# Altium schematic sheet Dual_Processors.SchDoc: FPGA TSK3000 Dual Processor example
size C; Organization: Altium Limited; Address1: L3, 12a Rodborough Rd; Address2: Frenchs Forest; Address3: NSW; Address4: Australia 2086; DocumentNumber: 1; SheetNumber: 1; SheetTotal: 1
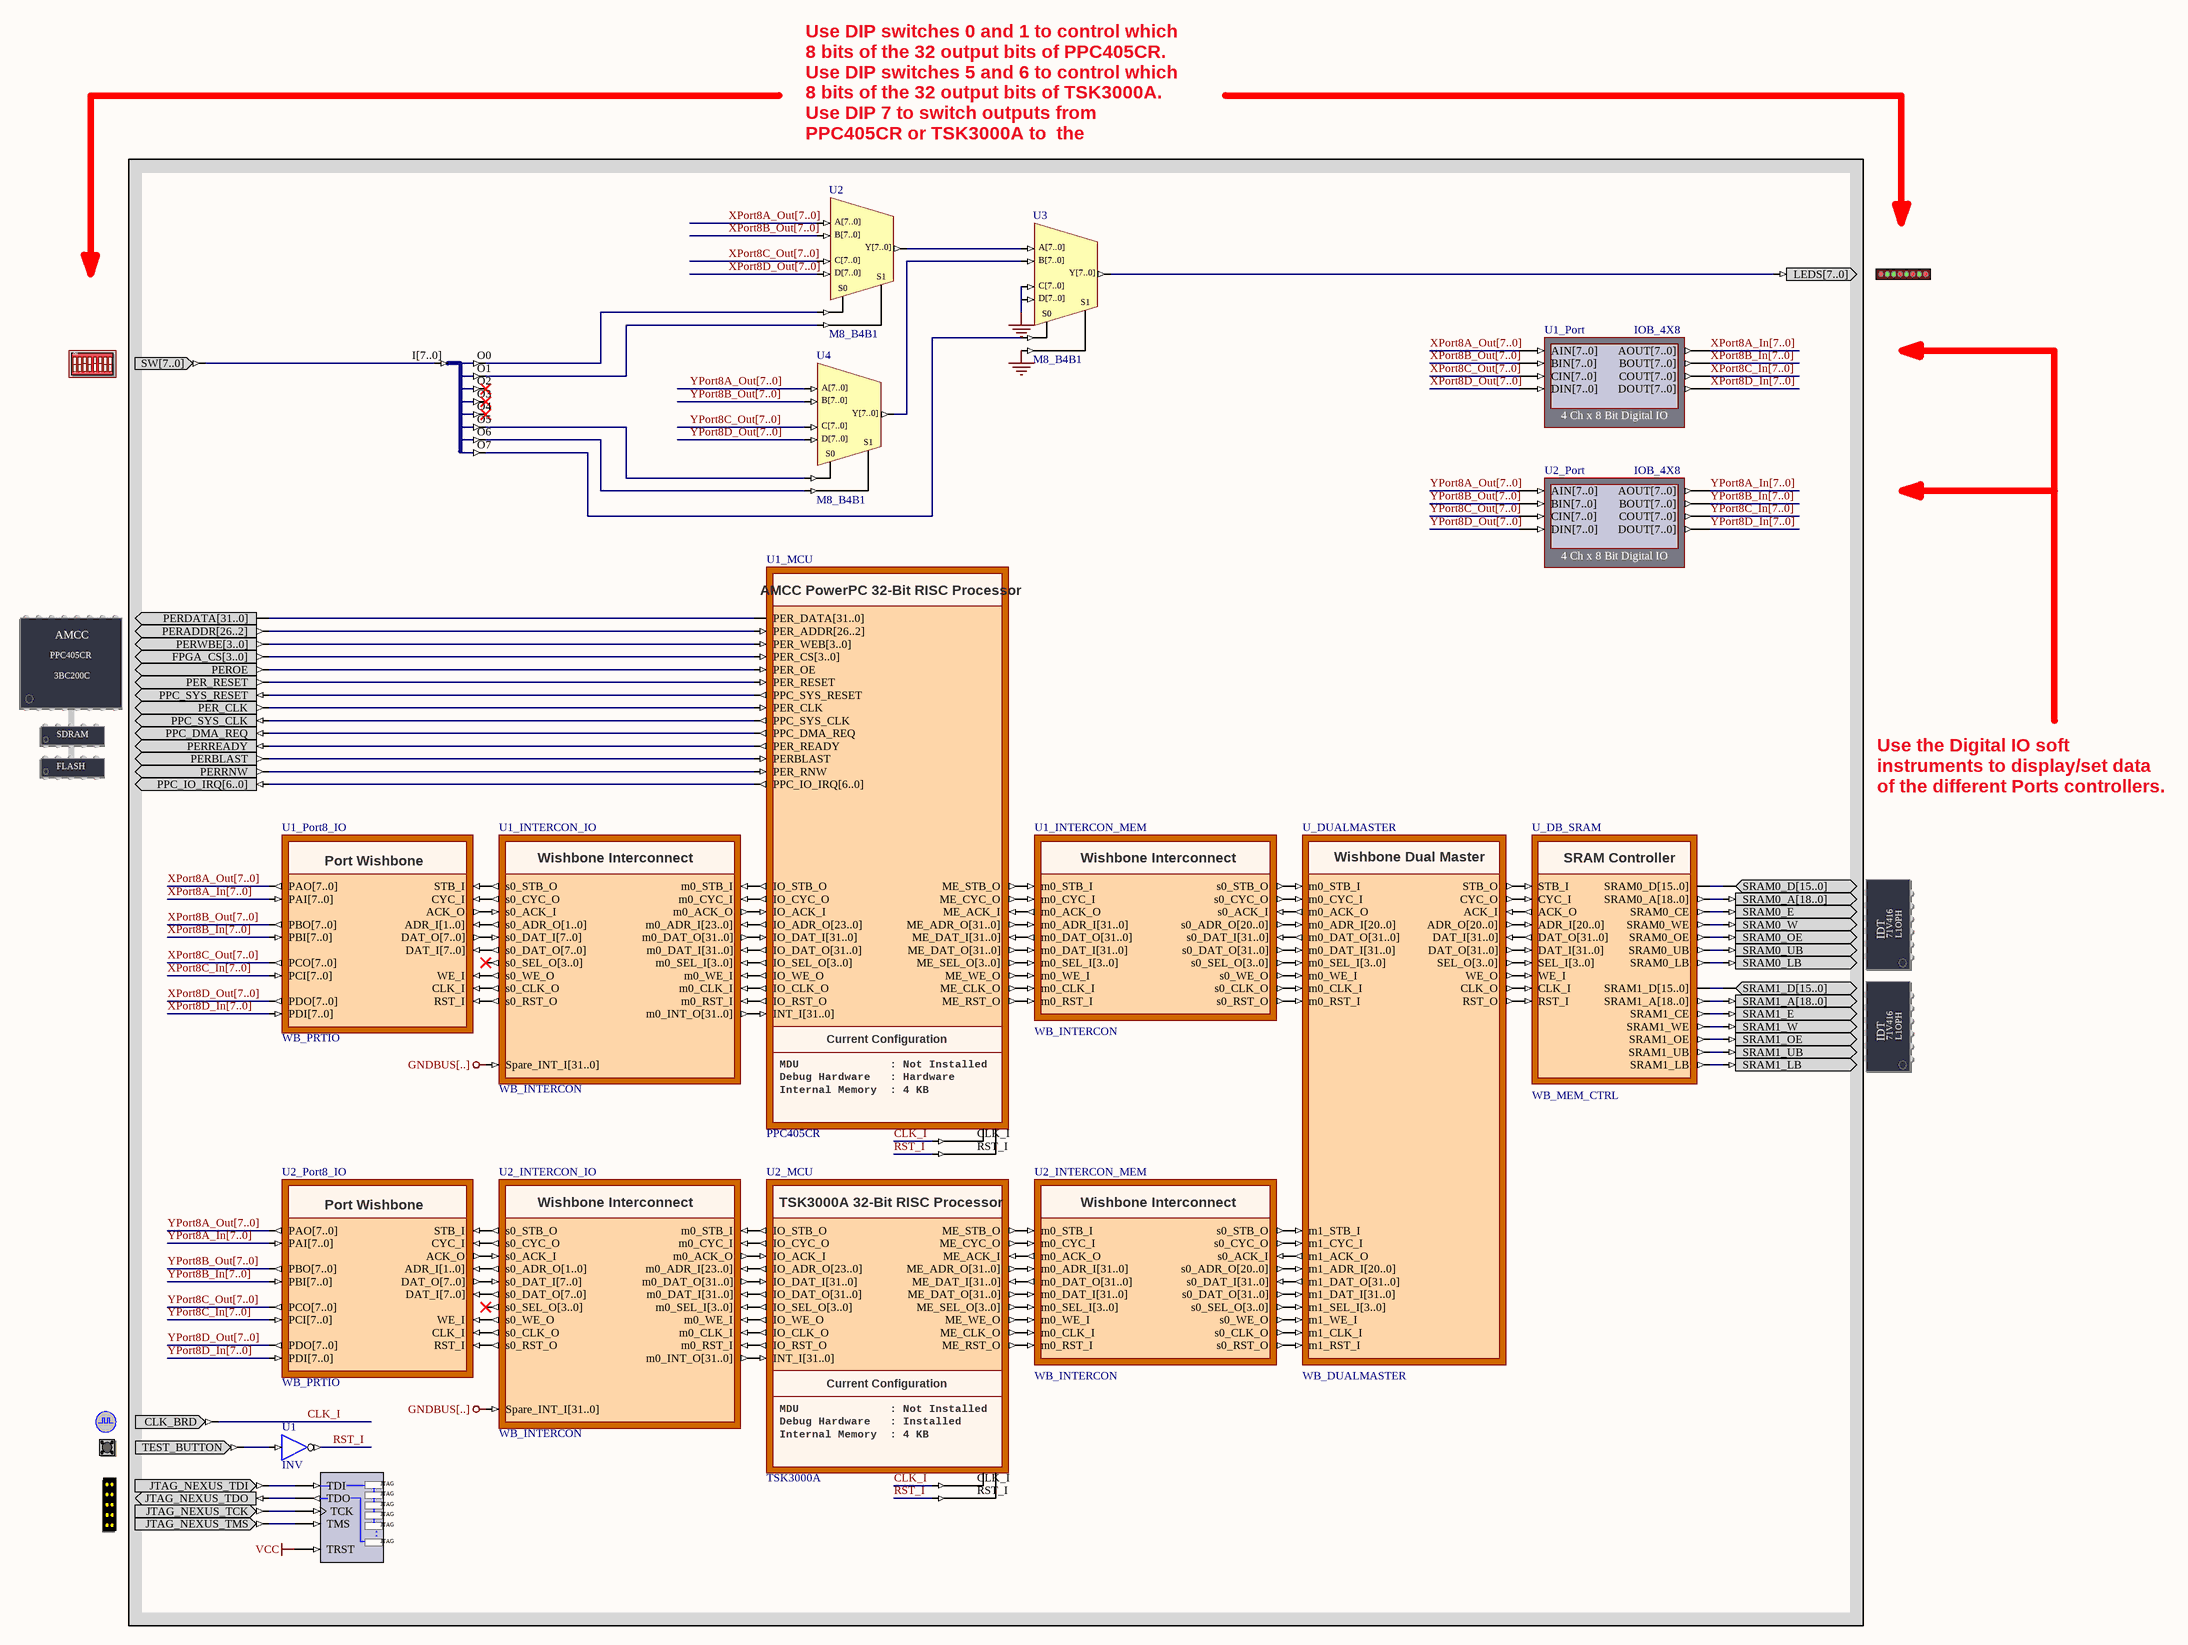
[diagram p0: Dual_Processors.SchDoc]

## Parts
(Parts that share a designator on the sheet are numbered #1, #2 ... from top to bottom, then left to right.)
?#1  LED  (value not drawn)
?#2  DIPSWITCH  (value not drawn)
?#3  PROCESSOR_PPC405CR  (value not drawn)
?#4  SRAM_DAUGHTER0  (value not drawn)
?#5  SRAM_DAUGHTER1  (value not drawn)
?#6  CLOCK_BOARD  (value not drawn)
?#7  TEST_BUTTON  (value not drawn)
?#8  NEXUS_JTAG_CONNECTOR  (value not drawn)
NEXUS_JTAG_PORT  NEXUS_JTAG_PORT  (value not drawn)
U1  INV
U1_INTERCON_IO  WB_INTERCON
U1_INTERCON_MEM  WB_INTERCON
U1_MCU  PPC405CR
U1_Port  IOB_4X8
U1_Port8_IO  WB_PRTIO
U2  M8_B4B1
U2_INTERCON_IO  WB_INTERCON
U2_INTERCON_MEM  WB_INTERCON
U2_MCU  TSK3000A
U2_Port  IOB_4X8
U2_Port8_IO  WB_PRTIO
U3  M8_B4B1
U4  M8_B4B1
U11  J8B_8S  (value not drawn)
U_DB_SRAM  WB_MEM_CTRL
U_DUALMASTER  WB_DUALMASTER

## Nets
GND: U3.S1
GNDBUS[..]: U1_INTERCON_IO.Spare_INT_I[31..0] U2_INTERCON_IO.Spare_INT_I[31..0] U3.C[7..0] U3.D[7..0]
VCC: NEXUS_JTAG_PORT.TRST
CLK_I: ?#6.CLK_BRD U1_MCU.CLK_I U2_MCU.CLK_I
RST_I: U1.O U1_MCU.RST_I U2_MCU.RST_I
XPort8A_In[7..0]: U1_Port.AOUT[7..0] U1_Port8_IO.PAI[7..0]
XPort8A_Out[7..0]: U1_Port.AIN[7..0] U1_Port8_IO.PAO[7..0] U2.A[7..0]
XPort8B_In[7..0]: U1_Port.BOUT[7..0] U1_Port8_IO.PBI[7..0]
XPort8B_Out[7..0]: U1_Port.BIN[7..0] U1_Port8_IO.PBO[7..0] U2.B[7..0]
XPort8C_In[7..0]: U1_Port.COUT[7..0] U1_Port8_IO.PCI[7..0]
XPort8C_Out[7..0]: U1_Port.CIN[7..0] U1_Port8_IO.PCO[7..0] U2.C[7..0]
XPort8D_In[7..0]: U1_Port.DOUT[7..0] U1_Port8_IO.PDI[7..0]
XPort8D_Out[7..0]: U1_Port.DIN[7..0] U1_Port8_IO.PDO[7..0] U2.D[7..0]
YPort8A_In[7..0]: U2_Port.AOUT[7..0] U2_Port8_IO.PAI[7..0]
YPort8A_Out[7..0]: U2_Port.AIN[7..0] U2_Port8_IO.PAO[7..0] U4.A[7..0]
YPort8B_In[7..0]: U2_Port.BOUT[7..0] U2_Port8_IO.PBI[7..0]
YPort8B_Out[7..0]: U2_Port.BIN[7..0] U2_Port8_IO.PBO[7..0] U4.B[7..0]
YPort8C_In[7..0]: U2_Port.COUT[7..0] U2_Port8_IO.PCI[7..0]
YPort8C_Out[7..0]: U2_Port.CIN[7..0] U2_Port8_IO.PCO[7..0] U4.C[7..0]
YPort8D_In[7..0]: U2_Port.DOUT[7..0] U2_Port8_IO.PDI[7..0]
YPort8D_Out[7..0]: U2_Port.DIN[7..0] U2_Port8_IO.PDO[7..0] U4.D[7..0]
Net?#1_LEDS[7..0]: ?#1.LEDS[7..0] U3.Y[7..0]
Net?#2_SW[7..0]: ?#2.SW[7..0] U11.I[7..0]
Net?#3_FPGA_CS[3..0]: ?#3.FPGA_CS[3..0] U1_MCU.PER_CS[3..0]
Net?#3_PER_CLK: ?#3.PER_CLK U1_MCU.PER_CLK
Net?#3_PER_RESET: ?#3.PER_RESET U1_MCU.PER_RESET
Net?#3_PERADDR[26..2]: ?#3.PERADDR[26..2] U1_MCU.PER_ADDR[26..2]
Net?#3_PERBLAST: ?#3.PERBLAST U1_MCU.PERBLAST
Net?#3_PERDATA[31..0]: ?#3.PERDATA[31..0] U1_MCU.PER_DATA[31..0]
Net?#3_PEROE: ?#3.PEROE U1_MCU.PER_OE
Net?#3_PERREADY: ?#3.PERREADY U1_MCU.PER_READY
Net?#3_PERRNW: ?#3.PERRNW U1_MCU.PER_RNW
Net?#3_PERWBE[3..0]: ?#3.PERWBE[3..0] U1_MCU.PER_WEB[3..0]
Net?#3_PPC_DMA_REQ: ?#3.PPC_DMA_REQ U1_MCU.PPC_DMA_REQ
Net?#3_PPC_IO_IRQ[6..0]: ?#3.PPC_IO_IRQ[6..0] U1_MCU.PPC_IO_IRQ[6..0]
Net?#3_PPC_SYS_CLK: ?#3.PPC_SYS_CLK U1_MCU.PPC_SYS_CLK
Net?#3_PPC_SYS_RESET: ?#3.PPC_SYS_RESET U1_MCU.PPC_SYS_RESET
Net?#4_SRAM0_A[18..0]: ?#4.SRAM0_A[18..0] U_DB_SRAM.SRAM0_A[18..0]
Net?#4_SRAM0_D[15..0]: ?#4.SRAM0_D[15..0] U_DB_SRAM.SRAM0_D[15..0]
Net?#4_SRAM0_E: ?#4.SRAM0_E U_DB_SRAM.SRAM0_CE
Net?#4_SRAM0_LB: ?#4.SRAM0_LB U_DB_SRAM.SRAM0_LB
Net?#4_SRAM0_OE: ?#4.SRAM0_OE U_DB_SRAM.SRAM0_OE
Net?#4_SRAM0_UB: ?#4.SRAM0_UB U_DB_SRAM.SRAM0_UB
Net?#4_SRAM0_W: ?#4.SRAM0_W U_DB_SRAM.SRAM0_WE
Net?#5_SRAM1_A[18..0]: ?#5.SRAM1_A[18..0] U_DB_SRAM.SRAM1_A[18..0]
Net?#5_SRAM1_D[15..0]: ?#5.SRAM1_D[15..0] U_DB_SRAM.SRAM1_D[15..0]
Net?#5_SRAM1_E: ?#5.SRAM1_E U_DB_SRAM.SRAM1_CE
Net?#5_SRAM1_LB: ?#5.SRAM1_LB U_DB_SRAM.SRAM1_LB
Net?#5_SRAM1_OE: ?#5.SRAM1_OE U_DB_SRAM.SRAM1_OE
Net?#5_SRAM1_UB: ?#5.SRAM1_UB U_DB_SRAM.SRAM1_UB
Net?#5_SRAM1_W: ?#5.SRAM1_W U_DB_SRAM.SRAM1_WE
Net?#7_TEST_BUTTON: ?#7.TEST_BUTTON U1.I
Net?#8_JTAG_NEXUS_TCK: ?#8.JTAG_NEXUS_TCK NEXUS_JTAG_PORT.TCK
Net?#8_JTAG_NEXUS_TDI: ?#8.JTAG_NEXUS_TDI NEXUS_JTAG_PORT.TDI
Net?#8_JTAG_NEXUS_TDO: ?#8.JTAG_NEXUS_TDO NEXUS_JTAG_PORT.TDO
Net?#8_JTAG_NEXUS_TMS: ?#8.JTAG_NEXUS_TMS NEXUS_JTAG_PORT.TMS
NetU1_INTERCON_IO_m0_ACK_O: U1_INTERCON_IO.m0_ACK_O U1_MCU.IO_ACK_I
NetU1_INTERCON_IO_m0_ADR_I[23..0]: U1_INTERCON_IO.m0_ADR_I[23..0] U1_MCU.IO_ADR_O[23..0]
NetU1_INTERCON_IO_m0_CLK_I: U1_INTERCON_IO.m0_CLK_I U1_MCU.IO_CLK_O
NetU1_INTERCON_IO_m0_CYC_I: U1_INTERCON_IO.m0_CYC_I U1_MCU.IO_CYC_O
NetU1_INTERCON_IO_m0_DAT_I[31..0]: U1_INTERCON_IO.m0_DAT_I[31..0] U1_MCU.IO_DAT_O[31..0]
NetU1_INTERCON_IO_m0_DAT_O[31..0]: U1_INTERCON_IO.m0_DAT_O[31..0] U1_MCU.IO_DAT_I[31..0]
NetU1_INTERCON_IO_m0_INT_O[31..0]: U1_INTERCON_IO.m0_INT_O[31..0] U1_MCU.INT_I[31..0]
NetU1_INTERCON_IO_m0_RST_I: U1_INTERCON_IO.m0_RST_I U1_MCU.IO_RST_O
NetU1_INTERCON_IO_m0_SEL_I[3..0]: U1_INTERCON_IO.m0_SEL_I[3..0] U1_MCU.IO_SEL_O[3..0]
NetU1_INTERCON_IO_m0_STB_I: U1_INTERCON_IO.m0_STB_I U1_MCU.IO_STB_O
NetU1_INTERCON_IO_m0_WE_I: U1_INTERCON_IO.m0_WE_I U1_MCU.IO_WE_O
NetU1_INTERCON_IO_s0_ACK_I: U1_INTERCON_IO.s0_ACK_I U1_Port8_IO.ACK_O
NetU1_INTERCON_IO_s0_ADR_O[1..0]: U1_INTERCON_IO.s0_ADR_O[1..0] U1_Port8_IO.ADR_I[1..0]
NetU1_INTERCON_IO_s0_CLK_O: U1_INTERCON_IO.s0_CLK_O U1_Port8_IO.CLK_I
NetU1_INTERCON_IO_s0_CYC_O: U1_INTERCON_IO.s0_CYC_O U1_Port8_IO.CYC_I
NetU1_INTERCON_IO_s0_DAT_I[7..0]: U1_INTERCON_IO.s0_DAT_I[7..0] U1_Port8_IO.DAT_O[7..0]
NetU1_INTERCON_IO_s0_DAT_O[7..0]: U1_INTERCON_IO.s0_DAT_O[7..0] U1_Port8_IO.DAT_I[7..0]
NetU1_INTERCON_IO_s0_RST_O: U1_INTERCON_IO.s0_RST_O U1_Port8_IO.RST_I
NetU1_INTERCON_IO_s0_STB_O: U1_INTERCON_IO.s0_STB_O U1_Port8_IO.STB_I
NetU1_INTERCON_IO_s0_WE_O: U1_INTERCON_IO.s0_WE_O U1_Port8_IO.WE_I
NetU1_INTERCON_MEM_m0_ACK_O: U1_INTERCON_MEM.m0_ACK_O U1_MCU.ME_ACK_I
NetU1_INTERCON_MEM_m0_ADR_I[31..0]: U1_INTERCON_MEM.m0_ADR_I[31..0] U1_MCU.ME_ADR_O[31..0]
NetU1_INTERCON_MEM_m0_CLK_I: U1_INTERCON_MEM.m0_CLK_I U1_MCU.ME_CLK_O
NetU1_INTERCON_MEM_m0_CYC_I: U1_INTERCON_MEM.m0_CYC_I U1_MCU.ME_CYC_O
NetU1_INTERCON_MEM_m0_DAT_I[31..0]: U1_INTERCON_MEM.m0_DAT_I[31..0] U1_MCU.ME_DAT_O[31..0]
NetU1_INTERCON_MEM_m0_DAT_O[31..0]: U1_INTERCON_MEM.m0_DAT_O[31..0] U1_MCU.ME_DAT_I[31..0]
NetU1_INTERCON_MEM_m0_RST_I: U1_INTERCON_MEM.m0_RST_I U1_MCU.ME_RST_O
NetU1_INTERCON_MEM_m0_SEL_I[3..0]: U1_INTERCON_MEM.m0_SEL_I[3..0] U1_MCU.ME_SEL_O[3..0]
NetU1_INTERCON_MEM_m0_STB_I: U1_INTERCON_MEM.m0_STB_I U1_MCU.ME_STB_O
NetU1_INTERCON_MEM_m0_WE_I: U1_INTERCON_MEM.m0_WE_I U1_MCU.ME_WE_O
NetU1_INTERCON_MEM_s0_ACK_I: U1_INTERCON_MEM.s0_ACK_I U_DUALMASTER.m0_ACK_O
NetU1_INTERCON_MEM_s0_ADR_O[20..0]: U1_INTERCON_MEM.s0_ADR_O[20..0] U_DUALMASTER.m0_ADR_I[20..0]
NetU1_INTERCON_MEM_s0_CLK_O: U1_INTERCON_MEM.s0_CLK_O U_DUALMASTER.m0_CLK_I
NetU1_INTERCON_MEM_s0_CYC_O: U1_INTERCON_MEM.s0_CYC_O U_DUALMASTER.m0_CYC_I
NetU1_INTERCON_MEM_s0_DAT_I[31..0]: U1_INTERCON_MEM.s0_DAT_I[31..0] U_DUALMASTER.m0_DAT_O[31..0]
NetU1_INTERCON_MEM_s0_DAT_O[31..0]: U1_INTERCON_MEM.s0_DAT_O[31..0] U_DUALMASTER.m0_DAT_I[31..0]
NetU1_INTERCON_MEM_s0_RST_O: U1_INTERCON_MEM.s0_RST_O U_DUALMASTER.m0_RST_I
NetU1_INTERCON_MEM_s0_SEL_O[3..0]: U1_INTERCON_MEM.s0_SEL_O[3..0] U_DUALMASTER.m0_SEL_I[3..0]
NetU1_INTERCON_MEM_s0_STB_O: U1_INTERCON_MEM.s0_STB_O U_DUALMASTER.m0_STB_I
NetU1_INTERCON_MEM_s0_WE_O: U1_INTERCON_MEM.s0_WE_O U_DUALMASTER.m0_WE_I
NetU2_INTERCON_IO_m0_ACK_O: U2_INTERCON_IO.m0_ACK_O U2_MCU.IO_ACK_I
NetU2_INTERCON_IO_m0_ADR_I[23..0]: U2_INTERCON_IO.m0_ADR_I[23..0] U2_MCU.IO_ADR_O[23..0]
NetU2_INTERCON_IO_m0_CLK_I: U2_INTERCON_IO.m0_CLK_I U2_MCU.IO_CLK_O
NetU2_INTERCON_IO_m0_CYC_I: U2_INTERCON_IO.m0_CYC_I U2_MCU.IO_CYC_O
NetU2_INTERCON_IO_m0_DAT_I[31..0]: U2_INTERCON_IO.m0_DAT_I[31..0] U2_MCU.IO_DAT_O[31..0]
NetU2_INTERCON_IO_m0_DAT_O[31..0]: U2_INTERCON_IO.m0_DAT_O[31..0] U2_MCU.IO_DAT_I[31..0]
NetU2_INTERCON_IO_m0_INT_O[31..0]: U2_INTERCON_IO.m0_INT_O[31..0] U2_MCU.INT_I[31..0]
NetU2_INTERCON_IO_m0_RST_I: U2_INTERCON_IO.m0_RST_I U2_MCU.IO_RST_O
NetU2_INTERCON_IO_m0_SEL_I[3..0]: U2_INTERCON_IO.m0_SEL_I[3..0] U2_MCU.IO_SEL_O[3..0]
NetU2_INTERCON_IO_m0_STB_I: U2_INTERCON_IO.m0_STB_I U2_MCU.IO_STB_O
NetU2_INTERCON_IO_m0_WE_I: U2_INTERCON_IO.m0_WE_I U2_MCU.IO_WE_O
NetU2_INTERCON_IO_s0_ACK_I: U2_INTERCON_IO.s0_ACK_I U2_Port8_IO.ACK_O
NetU2_INTERCON_IO_s0_ADR_O[1..0]: U2_INTERCON_IO.s0_ADR_O[1..0] U2_Port8_IO.ADR_I[1..0]
NetU2_INTERCON_IO_s0_CLK_O: U2_INTERCON_IO.s0_CLK_O U2_Port8_IO.CLK_I
NetU2_INTERCON_IO_s0_CYC_O: U2_INTERCON_IO.s0_CYC_O U2_Port8_IO.CYC_I
NetU2_INTERCON_IO_s0_DAT_I[7..0]: U2_INTERCON_IO.s0_DAT_I[7..0] U2_Port8_IO.DAT_O[7..0]
NetU2_INTERCON_IO_s0_DAT_O[7..0]: U2_INTERCON_IO.s0_DAT_O[7..0] U2_Port8_IO.DAT_I[7..0]
NetU2_INTERCON_IO_s0_RST_O: U2_INTERCON_IO.s0_RST_O U2_Port8_IO.RST_I
NetU2_INTERCON_IO_s0_STB_O: U2_INTERCON_IO.s0_STB_O U2_Port8_IO.STB_I
NetU2_INTERCON_IO_s0_WE_O: U2_INTERCON_IO.s0_WE_O U2_Port8_IO.WE_I
NetU2_INTERCON_MEM_m0_ACK_O: U2_INTERCON_MEM.m0_ACK_O U2_MCU.ME_ACK_I
NetU2_INTERCON_MEM_m0_ADR_I[31..0]: U2_INTERCON_MEM.m0_ADR_I[31..0] U2_MCU.ME_ADR_O[31..0]
NetU2_INTERCON_MEM_m0_CLK_I: U2_INTERCON_MEM.m0_CLK_I U2_MCU.ME_CLK_O
NetU2_INTERCON_MEM_m0_CYC_I: U2_INTERCON_MEM.m0_CYC_I U2_MCU.ME_CYC_O
NetU2_INTERCON_MEM_m0_DAT_I[31..0]: U2_INTERCON_MEM.m0_DAT_I[31..0] U2_MCU.ME_DAT_O[31..0]
NetU2_INTERCON_MEM_m0_DAT_O[31..0]: U2_INTERCON_MEM.m0_DAT_O[31..0] U2_MCU.ME_DAT_I[31..0]
NetU2_INTERCON_MEM_m0_RST_I: U2_INTERCON_MEM.m0_RST_I U2_MCU.ME_RST_O
NetU2_INTERCON_MEM_m0_SEL_I[3..0]: U2_INTERCON_MEM.m0_SEL_I[3..0] U2_MCU.ME_SEL_O[3..0]
NetU2_INTERCON_MEM_m0_STB_I: U2_INTERCON_MEM.m0_STB_I U2_MCU.ME_STB_O
NetU2_INTERCON_MEM_m0_WE_I: U2_INTERCON_MEM.m0_WE_I U2_MCU.ME_WE_O
NetU2_INTERCON_MEM_s0_ACK_I: U2_INTERCON_MEM.s0_ACK_I U_DUALMASTER.m1_ACK_O
NetU2_INTERCON_MEM_s0_ADR_O[20..0]: U2_INTERCON_MEM.s0_ADR_O[20..0] U_DUALMASTER.m1_ADR_I[20..0]
NetU2_INTERCON_MEM_s0_CLK_O: U2_INTERCON_MEM.s0_CLK_O U_DUALMASTER.m1_CLK_I
NetU2_INTERCON_MEM_s0_CYC_O: U2_INTERCON_MEM.s0_CYC_O U_DUALMASTER.m1_CYC_I
NetU2_INTERCON_MEM_s0_DAT_I[31..0]: U2_INTERCON_MEM.s0_DAT_I[31..0] U_DUALMASTER.m1_DAT_O[31..0]
NetU2_INTERCON_MEM_s0_DAT_O[31..0]: U2_INTERCON_MEM.s0_DAT_O[31..0] U_DUALMASTER.m1_DAT_I[31..0]
NetU2_INTERCON_MEM_s0_RST_O: U2_INTERCON_MEM.s0_RST_O U_DUALMASTER.m1_RST_I
NetU2_INTERCON_MEM_s0_SEL_O[3..0]: U2_INTERCON_MEM.s0_SEL_O[3..0] U_DUALMASTER.m1_SEL_I[3..0]
NetU2_INTERCON_MEM_s0_STB_O: U2_INTERCON_MEM.s0_STB_O U_DUALMASTER.m1_STB_I
NetU2_INTERCON_MEM_s0_WE_O: U2_INTERCON_MEM.s0_WE_O U_DUALMASTER.m1_WE_I
NetU2_S0: U2.S0 U11.O0
NetU2_S1: U2.S1 U11.O1
NetU2_Y[7..0]: U2.Y[7..0] U3.A[7..0]
NetU3_B[7..0]: U3.B[7..0] U4.Y[7..0]
NetU3_S0: U3.S0 U11.O7
NetU4_S0: U4.S0 U11.O5
NetU4_S1: U4.S1 U11.O6
NetU_DB_SRAM_ACK_O: U_DB_SRAM.ACK_O U_DUALMASTER.ACK_I
NetU_DB_SRAM_ADR_I[20..0]: U_DB_SRAM.ADR_I[20..0] U_DUALMASTER.ADR_O[20..0]
NetU_DB_SRAM_CLK_I: U_DB_SRAM.CLK_I U_DUALMASTER.CLK_O
NetU_DB_SRAM_CYC_I: U_DB_SRAM.CYC_I U_DUALMASTER.CYC_O
NetU_DB_SRAM_DAT_I[31..0]: U_DB_SRAM.DAT_I[31..0] U_DUALMASTER.DAT_O[31..0]
NetU_DB_SRAM_DAT_O[31..0]: U_DB_SRAM.DAT_O[31..0] U_DUALMASTER.DAT_I[31..0]
NetU_DB_SRAM_RST_I: U_DB_SRAM.RST_I U_DUALMASTER.RST_O
NetU_DB_SRAM_SEL_I[3..0]: U_DB_SRAM.SEL_I[3..0] U_DUALMASTER.SEL_O[3..0]
NetU_DB_SRAM_STB_I: U_DB_SRAM.STB_I U_DUALMASTER.STB_O
NetU_DB_SRAM_WE_I: U_DB_SRAM.WE_I U_DUALMASTER.WE_O

Not connected (* = marked no-connect by the designer): U1_INTERCON_IO s0_SEL_O[3..0]*; U2_INTERCON_IO s0_SEL_O[3..0]*; U11 O2* O3* O4*

## Buses and harness runs
bus XPort8A_In[7..0]
bus XPort8A_Out[7..0]
bus XPort8B_In[7..0]
bus XPort8B_Out[7..0]
bus XPort8C_In[7..0]
bus XPort8C_Out[7..0]
bus XPort8D_In[7..0]
bus XPort8D_Out[7..0]
bus YPort8A_In[7..0]
bus YPort8A_Out[7..0]
bus YPort8B_In[7..0]
bus YPort8B_Out[7..0]
bus YPort8C_In[7..0]
bus YPort8C_Out[7..0]
bus YPort8D_In[7..0]
bus YPort8D_Out[7..0]

## Notes on the sheet
- Use DIP switches 0 and 1 to control which 8 bits of the 32 output bits of PPC405CR.
  Use DIP switches 5 and 6 to control which 8 bits of the 32 output bits of TSK3000A.
  Use DIP 7 to switch outputs from PPC405CR or TSK3000A to  the NanoBoard LEDs.
- Use the Digital IO soft instruments to display/set data of the different Ports controllers.
- Title
- Size:
- Date:
- File:
- C
- Number:
- Time:
- Revision:
- Sheet
- of
- (in symbol DIPSWITCH) ON; 1; 2; 3; 4; 5; 6; 7; 8
- (in symbol NEXUS_JTAG_PORT) JTAG; .
- (in symbol PPC405CR) AMCC PowerPC 32-Bit RISC Processor; Current Configuration; MDU              : Not Installed; Debug Hardware   : Hardware; Internal Memory  : 4 KB
- (in symbol PROCESSOR_PPC405CR) AMCC; PPC405CR; 3BC200C; SDRAM; FLASH
- (in symbol SRAM_DAUGHTER0) IDT; 71V416; L1OPH
- (in symbol SRAM_DAUGHTER1) IDT; 71V416; L1OPH
- (in symbol TSK3000A) TSK3000A 32-Bit RISC Processor; Current Configuration; MDU              : Not Installed; Debug Hardware   : Installed; Internal Memory  : 4 KB
- (in symbol WB_DUALMASTER) Wishbone Dual Master
- (in symbol WB_INTERCON) Wishbone Interconnect
- (in symbol WB_MEM_CTRL) SRAM Controller
- (in symbol WB_PRTIO) Port Wishbone

## Library data of the parts
?#1 = LED: 8-Way LEDS; PortComponent: True; Published: 19-Nov-2003; Publisher: Altium Limited
?#2 = DIPSWITCH: 8-Way Dip Switch; PortComponent: True; Published: 19-Nov-2003; Publisher: Altium Limited
?#3 = PROCESSOR_PPC405CR: AMCC PowerPC 405CR Embedded Processor; PortComponent: True; Published: 25-Aug-2005; Publisher: Altium Limited; HelpURL: https://www.amcc.com/MyAMCC/jsp/public/productDetail/product_detail.jsp?productID=PPC405CR
?#4 = SRAM_DAUGHTER0: SRAM - 0 Module - Daughterboard; PortComponent: True; Published: 13-May-2004; Publisher: Altium Limited
?#5 = SRAM_DAUGHTER1: SRAM - 1 Module - Daughterboard; PortComponent: True; Published: 13-May-2004; Publisher: Altium Limited
?#6 = CLOCK_BOARD: Global System Clock Supply; PortComponent: True; Published: 19-Nov-2003; Publisher: Altium Limited
?#7 = TEST_BUTTON: Test Button; PortComponent: True; Published: 19-Nov-2003; Publisher: Altium Limited
?#8 = NEXUS_JTAG_CONNECTOR: JTAG Port; PortComponent: True; Published: 19-Nov-2003; Publisher: Altium Limited
NEXUS_JTAG_PORT = NEXUS_JTAG_PORT: Soft Nexus-Chain Connector; NEXUS_JTAG_CONNECTOR: True; Published: 18-Dec-2003; Publisher: Altium Limited
U1 = INV: Inverter; ArchiveName: GENERIC; FunctionalClass: Logic Primitive; VHDLIB_SIM: GENERIC_LIB; Published: 29-Jan-2004; Publisher: Altium Limited; ComponentLink1Description: Core &Resource Usage; ComponentLink1URL: CR0136 FPGA Logic Primitive Resource Usage.pdf#page=61; HelpURL: CR0118 FPGA Generic Library Guide.pdf#page=290; LastRevisionNo: 1.00.00; SubClass: INV; XilinxEquivalent: INV
U1_INTERCON_IO = WB_INTERCON: Configurable Wishbone Interconnect; ConfigurationParameters: {}UnusedInterrupts[0]{}MasterAddressBits[1]{}Name0[Port32]{}Kind0[0]{}SpaceAfter0[4]{}Address_Base0[0]{}Address_UsedRange0[4]{}Address_Bits0[2]{}Address_Mode0[0]{}Address_DecodeWidth0[4]{}DataWidth0[2]{}UsedInterrupts0[]; ComponentLink1Description: Core &Resource Usage; ComponentLink1URL: CR0139 FPGA Peripheral Resource Usage.pdf#page=51; HelpURL: CR0150 WB_INTERCON Configurable Wishbone Interconnect.pdf#page=2; LastRevisionNo: 1.00.00; Published: 9-Dec-2004; Publisher: Altium Limited; ConfiguratorName: WB_INTERCON
U1_INTERCON_MEM U2_INTERCON_MEM = WB_INTERCON: Configurable Wishbone Interconnect; ConfigurationParameters: {}UnusedInterrupts[2]{}MasterAddressBits[0]{}Name0[RAM]{}Kind0[2]{}SpaceAfter0[12]{}Address_Base0[16777216]{}Address_UsedRange0[524288]{}Address_Bits0[21]{}Address_Mode0[1]{}Address_DecodeWidth0[8]{}DataWidth0[0]{}UsedInterrupts0[]; ComponentLink1Description: Core &Resource Usage; ComponentLink1URL: CR0139 FPGA Peripheral Resource Usage.pdf#page=51; HelpURL: CR0150 WB_INTERCON Configurable Wishbone Interconnect.pdf#page=2; LastRevisionNo: 1.00.00; Published: 9-Dec-2004; Publisher: Altium Limited; ConfiguratorName: WB_INTERCON
U1_MCU = PPC405CR: AMCC PowerPC PPC405 RISC Processor; ChildModel1: TSK3000A_MCU; Nexus_JTAG_Device: False; Nexus_Core: Processor_Hard; Nexus_JTAG_Order: 0; ChildModel2: TSK3000A_MDU; ChildModel3: TSK3000A_OCDS; ChildModel4: TSK3000A_Shift_Barrel; ChildModel5: TSK3000A_Shift_Sequential; ChildModel6: Mult_32x32; ConfigurationParameters: {}Version[1.0]{}Option_Processor[2]{}Option_Memory[2]{}Option_MDU[1]{}Option_OCDS[2]{}Option_Shifter[0]{}Option_InterruptCount[32]{}Option_DebugWhenReset[0]{}; ChildModel7: m33x33; Memory_Configuration: Record[PERIPHERAL]{}ComponentDesignator[Port8]{}Memory_Depth[0x0004]{}Memory_UsageType[ram]{}ProgramDownloadAddress[0xFF000000]{}Memory_BusType[PPC:local_bus]{}Memory_Mau[8]{}Memory_MatchedComponent[]{}Memory_Description[U2_INTERCON_IO]{}Memory_FillBitPattern[]{}Memory_Interrupts[]{n}Record[CODE_EXPORT]{}ExportType[]{n}Record[NEXUS_CORE]{}ComponentDesignator[U1_MCU]{}Memory_Depth[4096]{}Memory_UsageType[rom]{}ProgramDownloadAddress[0x00000000]{}Memory_BusType[PPC:local_bus]{}Memory_Mau[8]{}Memory_MatchedComponent[]{}Memory_Description[]{}Memory_FillBitPattern[]{}Memory_Interrupts[]{n}Record[NEXUS_CORE]{}ComponentDesignator[RAM]{}Memory_Depth[0x200000]{}Memory_UsageType[ram]{}ProgramDownloadAddress[0x1000000]{}Memory_BusType[PPC:local_bus]{}Memory_Mau[8]{}Memory_MatchedComponent[]{}Memory_Description[U1_INTERCON_MEM]{}Memory_FillBitPattern[]{}Memory_Interrupts[]{n}; ConfiguratorName: FPGA_MCU32; ProgramLogicalTopAddress: 0; ComponentLink1Description: Core &Resource Usage; ComponentLink1URL: CR0140 FPGA Processor Resource Usage.pdf#page=16; HelpURL: CR0121 TSK3000A 32 bit RISC Processor.pdf#page=6; LastRevisionNo: 1.00.00; Published: 17-Nov-2004; Publisher: Altium Limited
U1_Port U2_Port = IOB_4X8: 4 Ch x 8 Bit Digital IO; NEXUS_CORE: Instrument; NEXUS_JTAG_DEVICE: True; NEXUS_JTAG_ORDER: 0; Published: 3-Nov-2004; Publisher: Altium Limited; LastRevisionNo: 1.00.00; HelpURL: CR0102 IOB_x Digital IO Module.pdf#page=2; ComponentLink1Description: Core &Resource Usage; ComponentLink1URL: CR0134 FPGA Instrument Resource Usage.pdf#page=8
U1_Port8_IO U2_Port8_IO = WB_PRTIO: Configurable Port Wishbone; ChildModel: PRTIO4X8_W; ConfigurationParameters: {}PortCount[4]{}BusWidth[8]{}PortKind[0]{}; UseInDSF: True; ComponentLink1Description: Core &Resource Usage; ComponentLink1URL: CR0139 FPGA Peripheral Resource Usage.pdf#page=63; HelpURL: CR0154 WB_PRTIO Configurable Wishbone Parallel Port Unit.pdf#page=2; LastRevisionNo: 1.00.00; Published: 9-Dec-2004; Publisher: Altium Limited; ConfiguratorName: WB_PRTIO
U2-U4 = M8_B4B1: 4x8-Bit Bus to 1x8-Bit Bus Multiplexer; SubClass: BnB1; PortSize: 8; PortStyle: Bus Version; ArchiveName: GENERIC; VHDLIB_SIM: GENERIC_LIB; Published: 29-Jan-2004; Publisher: Altium Limited; LastRevisionNo: 1.00.00; HelpURL: CR0118 FPGA Generic Library Guide.pdf#page=370; ComponentLink1URL: CR0137 FPGA Multiplexer Resource Usage.pdf#page=304; ComponentLink1Description: Core &Resource Usage; FunctionalClass: Multiplexer
U2_INTERCON_IO = WB_INTERCON: Configurable Wishbone Interconnect; ConfigurationParameters: {}UnusedInterrupts[0]{}MasterAddressBits[1]{}Name0[Port8]{}Kind0[0]{}SpaceAfter0[4]{}Address_Base0[0]{}Address_UsedRange0[4]{}Address_Bits0[2]{}Address_Mode0[0]{}Address_DecodeWidth0[4]{}DataWidth0[2]{}UsedInterrupts0[]; ComponentLink1Description: Core &Resource Usage; ComponentLink1URL: CR0139 FPGA Peripheral Resource Usage.pdf#page=51; HelpURL: CR0150 WB_INTERCON Configurable Wishbone Interconnect.pdf#page=2; LastRevisionNo: 1.00.00; Published: 9-Dec-2004; Publisher: Altium Limited; ConfiguratorName: WB_INTERCON
U2_MCU = TSK3000A: TSK3000A OCD Microprocessor; ChildModel1: TSK3000A_MCU; Nexus_JTAG_Device: True; Nexus_Core: Processor_OCDS; Nexus_JTAG_Order: 0; ChildModel2: TSK3000A_MDU; ChildModel3: TSK3000A_OCDS; ChildModel4: TSK3000A_Shift_Barrel; ChildModel5: TSK3000A_Shift_Sequential; ChildModel6: Mult_32x32; ConfigurationParameters: {}Version[1.0]{}Option_Processor[0]{}Option_Memory[2]{}Option_MDU[1]{}Option_OCDS[0]{}Option_Shifter[0]{}Option_InterruptCount[32]{}Option_DebugWhenReset[0]{}; ChildModel7: m33x33; Memory_Configuration: Record[CODE_EXPORT]{}ExportType[]{n}Record[NEXUS_CORE]{}ComponentDesignator[U2_MCU]{}Memory_Depth[4096]{}Memory_UsageType[rom]{}ProgramDownloadAddress[0]{}Memory_BusType[TSK3000:addr_bus]{}Memory_Mau[8]{}Memory_MatchedComponent[]{}Memory_Description[]{}Memory_FillBitPattern[]{n}Record[NEXUS_CORE]{}ComponentDesignator[RAM]{}Memory_Depth[0x200000]{}Memory_UsageType[ram]{}ProgramDownloadAddress[0x1000000]{}Memory_BusType[TSK3000:addr_bus]{}Memory_Mau[8]{}Memory_MatchedComponent[]{}Memory_Description[U2_INTERCON_MEM]{}Memory_FillBitPattern[]{n}; ConfiguratorName: FPGA_MCU32; ProgramLogicalTopAddress: 0; ComponentLink1Description: Core &Resource Usage; ComponentLink1URL: CR0140 FPGA Processor Resource Usage.pdf#page=16; HelpURL: CR0121 TSK3000A 32 bit RISC Processor.pdf#page=6; LastRevisionNo: 1.00.00; Published: 17-Nov-2004; Publisher: Altium Limited
U11 = J8B_8S: 8-Bit input bus to 8 single pin outputs; ArchiveName: GENERIC; VHDLIB_SIM: GENERIC_LIB; FunctionalClass: Bus Joiner; PortSize: 8; Published: 29-Jan-2004; Publisher: Altium Limited; ComponentLink1Description: Core &Resource Usage; ComponentLink1URL: CR0126 FPGA Bus Joiner Resource Usage.pdf#page=27; HelpURL: CR0118 FPGA Generic Library Guide.pdf#page=303; LastRevisionNo: 1.00.00
U_DB_SRAM = WB_MEM_CTRL: Configurable Memory Controller; ConfigurationParameters: {}Option_MemoryType[Asynchronous SRAM]{}Option_MemorySize[2 Mb (512K x 32-bit)]{}Option_Layout[2 x 16-bit Wide Devices]{}Option_Read[2]{}Option_WriteSetup[1]{}Option_WritePulse[1]{}Option_WriteHold[1]{}; ComponentLink1Description: Core &Resource Usage; ComponentLink1URL: CR0139 FPGA Peripheral Resource Usage.pdf#page=58; HelpURL: CR0152 WB_MEM_CTRL Configurable Wishbone Memory Controller.pdf#page=2; LastRevisionNo: 1.00.00; Published: 9-Dec-2004; Publisher: Altium Limited; ConfiguratorName: WB_MEM_CTRL
U_DUALMASTER = WB_DUALMASTER: Configurable Wishbone Dual Master; ConfigurationParameters: {}DataWidth[0]{}AddressWidth[21]{}SpaceAfter[18]{}DualType[0]{}PriorityDevice[0]; ComponentLink1Description: Core &Resource Usage; ComponentLink1URL: CR0139 FPGA Peripheral Resource Usage.pdf#page=45; HelpURL: CR0151 WB_DUALMASTER Configurable Wishbone Dual Master.pdf#page=2; LastRevisionNo: 1.00.00; Published: 9-Dec-2004; Publisher: Altium Limited; ConfiguratorName: WB_DUALMASTER